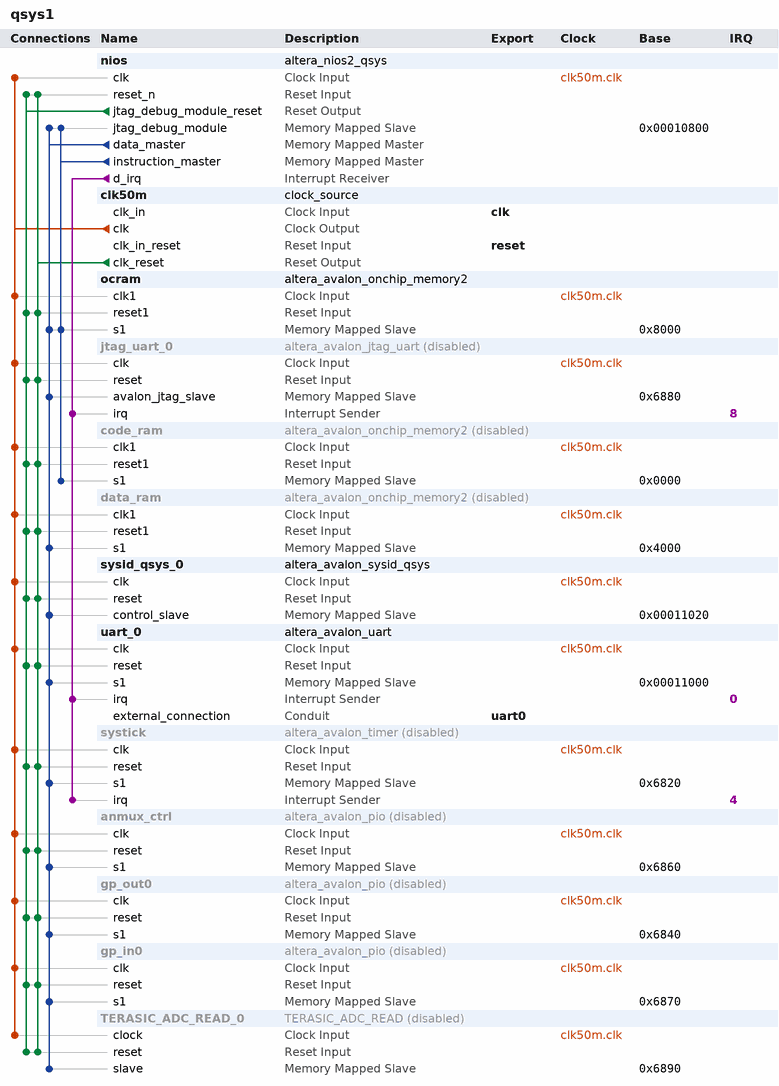
[diagram p0: system contents]
# Platform Designer (Qsys) system qsys1, Cyclone IV E EP4CE22F17C6
# Parameters at their usual value, and those the tool derives, are not listed.
package require -exact qsys 13.0.1
create_system qsys1
set_project_property DEVICE_FAMILY {Cyclone IV E}
set_project_property DEVICE EP4CE22F17C6

add_instance nios altera_nios2_qsys 13.0
set_instance_parameter_value nios setting_illegalInstructionsTrap true
set_instance_parameter_value nios resetOffset 32768
set_instance_parameter_value nios exceptionOffset 32800
set_instance_parameter_value nios resetSlave Absolute
set_instance_parameter_value nios exceptionSlave Absolute
set_instance_parameter_value nios breakSlave nios.jtag_debug_module
set_instance_parameter_value nios impl Tiny
set_instance_parameter_value nios icache_size 4096

add_instance clk50m clock_source 13.0
set_instance_parameter_value clk50m clockFrequency 50000000

add_instance ocram altera_avalon_onchip_memory2 13.0.1
set_instance_parameter_value ocram blockType M9K
set_instance_parameter_value ocram dataWidth 32
set_instance_parameter_value ocram dualPort false
set_instance_parameter_value ocram initMemContent true
set_instance_parameter_value ocram initializationFileName onchip_mem.hex
set_instance_parameter_value ocram memorySize 32768

add_instance jtag_uart_0 altera_avalon_jtag_uart 13.0.1
set_instance_property jtag_uart_0 ENABLED false
set_instance_parameter_value jtag_uart_0 simInteractiveOptions INTERACTIVE_ASCII_OUTPUT

add_instance code_ram altera_avalon_onchip_memory2 13.0.1
set_instance_property code_ram ENABLED false
set_instance_parameter_value code_ram allowInSystemMemoryContentEditor true
set_instance_parameter_value code_ram blockType M9K
set_instance_parameter_value code_ram dataWidth 32
set_instance_parameter_value code_ram dualPort false
set_instance_parameter_value code_ram initMemContent true
set_instance_parameter_value code_ram initializationFileName code_ram
set_instance_parameter_value code_ram instanceID code
set_instance_parameter_value code_ram memorySize 16384

add_instance data_ram altera_avalon_onchip_memory2 13.0.1
set_instance_property data_ram ENABLED false
set_instance_parameter_value data_ram allowInSystemMemoryContentEditor true
set_instance_parameter_value data_ram blockType M9K
set_instance_parameter_value data_ram dataWidth 32
set_instance_parameter_value data_ram dualPort false
set_instance_parameter_value data_ram initMemContent true
set_instance_parameter_value data_ram initializationFileName data_ram
set_instance_parameter_value data_ram instanceID data
set_instance_parameter_value data_ram memorySize 8192

add_instance sysid_qsys_0 altera_avalon_sysid_qsys 13.0
set_instance_parameter_value sysid_qsys_0 id 0

add_instance uart_0 altera_avalon_uart 13.0.1
set_instance_parameter_value uart_0 baud 115200
set_instance_parameter_value uart_0 dataBits 8
set_instance_parameter_value uart_0 fixedBaud true
set_instance_parameter_value uart_0 parity NONE
set_instance_parameter_value uart_0 stopBits 1

add_instance systick altera_avalon_timer 13.0.1
set_instance_property systick ENABLED false
set_instance_parameter_value systick alwaysRun true
set_instance_parameter_value systick fixedPeriod true
set_instance_parameter_value systick period 1
set_instance_parameter_value systick periodUnits MSEC

add_instance anmux_ctrl altera_avalon_pio 13.0.1
set_instance_property anmux_ctrl ENABLED false
set_instance_parameter_value anmux_ctrl direction Output
set_instance_parameter_value anmux_ctrl width 4

add_instance gp_out0 altera_avalon_pio 13.0.1
set_instance_property gp_out0 ENABLED false
set_instance_parameter_value gp_out0 bitModifyingOutReg true
set_instance_parameter_value gp_out0 direction Output
set_instance_parameter_value gp_out0 width 32

add_instance gp_in0 altera_avalon_pio 13.0.1
set_instance_property gp_in0 ENABLED false
set_instance_parameter_value gp_in0 direction Input
set_instance_parameter_value gp_in0 width 32

add_instance TERASIC_ADC_READ_0 TERASIC_ADC_READ 1.0
set_instance_property TERASIC_ADC_READ_0 ENABLED false

# connections
add_connection clk50m.clk anmux_ctrl.clk clock
add_connection clk50m.clk code_ram.clk1 clock
add_connection clk50m.clk data_ram.clk1 clock
add_connection clk50m.clk gp_in0.clk clock
add_connection clk50m.clk gp_out0.clk clock
add_connection clk50m.clk jtag_uart_0.clk clock
add_connection clk50m.clk nios.clk clock
add_connection clk50m.clk ocram.clk1 clock
add_connection clk50m.clk sysid_qsys_0.clk clock
add_connection clk50m.clk systick.clk clock
add_connection clk50m.clk TERASIC_ADC_READ_0.clock clock
add_connection clk50m.clk uart_0.clk clock
add_connection clk50m.clk_reset anmux_ctrl.reset reset
add_connection clk50m.clk_reset code_ram.reset1 reset
add_connection clk50m.clk_reset data_ram.reset1 reset
add_connection clk50m.clk_reset gp_in0.reset reset
add_connection clk50m.clk_reset gp_out0.reset reset
add_connection clk50m.clk_reset jtag_uart_0.reset reset
add_connection clk50m.clk_reset nios.reset_n reset
add_connection clk50m.clk_reset ocram.reset1 reset
add_connection clk50m.clk_reset sysid_qsys_0.reset reset
add_connection clk50m.clk_reset systick.reset reset
add_connection clk50m.clk_reset TERASIC_ADC_READ_0.reset reset
add_connection clk50m.clk_reset uart_0.reset reset
add_connection nios.jtag_debug_module_reset anmux_ctrl.reset reset
add_connection nios.jtag_debug_module_reset code_ram.reset1 reset
add_connection nios.jtag_debug_module_reset data_ram.reset1 reset
add_connection nios.jtag_debug_module_reset gp_in0.reset reset
add_connection nios.jtag_debug_module_reset gp_out0.reset reset
add_connection nios.jtag_debug_module_reset jtag_uart_0.reset reset
add_connection nios.jtag_debug_module_reset nios.reset_n reset
add_connection nios.jtag_debug_module_reset ocram.reset1 reset
add_connection nios.jtag_debug_module_reset sysid_qsys_0.reset reset
add_connection nios.jtag_debug_module_reset systick.reset reset
add_connection nios.jtag_debug_module_reset TERASIC_ADC_READ_0.reset reset
add_connection nios.jtag_debug_module_reset uart_0.reset reset
add_connection nios.data_master anmux_ctrl.s1 avalon
set_connection_parameter_value nios.data_master/anmux_ctrl.s1 baseAddress 0x6860
add_connection nios.data_master data_ram.s1 avalon
set_connection_parameter_value nios.data_master/data_ram.s1 baseAddress 0x4000
add_connection nios.data_master gp_in0.s1 avalon
set_connection_parameter_value nios.data_master/gp_in0.s1 baseAddress 0x6870
add_connection nios.data_master gp_out0.s1 avalon
set_connection_parameter_value nios.data_master/gp_out0.s1 baseAddress 0x6840
add_connection nios.data_master jtag_uart_0.avalon_jtag_slave avalon
set_connection_parameter_value nios.data_master/jtag_uart_0.avalon_jtag_slave baseAddress 0x6880
add_connection nios.data_master nios.jtag_debug_module avalon
set_connection_parameter_value nios.data_master/nios.jtag_debug_module baseAddress 0x00010800
add_connection nios.data_master ocram.s1 avalon
set_connection_parameter_value nios.data_master/ocram.s1 baseAddress 0x8000
add_connection nios.data_master sysid_qsys_0.control_slave avalon
set_connection_parameter_value nios.data_master/sysid_qsys_0.control_slave baseAddress 0x00011020
add_connection nios.data_master systick.s1 avalon
set_connection_parameter_value nios.data_master/systick.s1 baseAddress 0x6820
add_connection nios.data_master TERASIC_ADC_READ_0.slave avalon
set_connection_parameter_value nios.data_master/TERASIC_ADC_READ_0.slave baseAddress 0x6890
add_connection nios.data_master uart_0.s1 avalon
set_connection_parameter_value nios.data_master/uart_0.s1 baseAddress 0x00011000
add_connection nios.instruction_master code_ram.s1 avalon
set_connection_parameter_value nios.instruction_master/code_ram.s1 baseAddress 0x0000
add_connection nios.instruction_master nios.jtag_debug_module avalon
set_connection_parameter_value nios.instruction_master/nios.jtag_debug_module baseAddress 0x00010800
add_connection nios.instruction_master ocram.s1 avalon
set_connection_parameter_value nios.instruction_master/ocram.s1 baseAddress 0x8000
add_connection nios.d_irq jtag_uart_0.irq interrupt
set_connection_parameter_value nios.d_irq/jtag_uart_0.irq irqNumber 8
add_connection nios.d_irq systick.irq interrupt
set_connection_parameter_value nios.d_irq/systick.irq irqNumber 4
add_connection nios.d_irq uart_0.irq interrupt
set_connection_parameter_value nios.d_irq/uart_0.irq irqNumber 0

# exported interfaces
add_interface clk clock sink
set_interface_property clk EXPORT_OF clk50m.clk_in
add_interface reset reset sink
set_interface_property reset EXPORT_OF clk50m.clk_in_reset
add_interface uart0 conduit end
set_interface_property uart0 EXPORT_OF uart_0.external_connection

set_interconnect_requirement {$system} qsys_mm.clockCrossingAdapter HANDSHAKE
set_interconnect_requirement {$system} qsys_mm.maxAdditionalLatency 1

save_system qsys1.qsys
